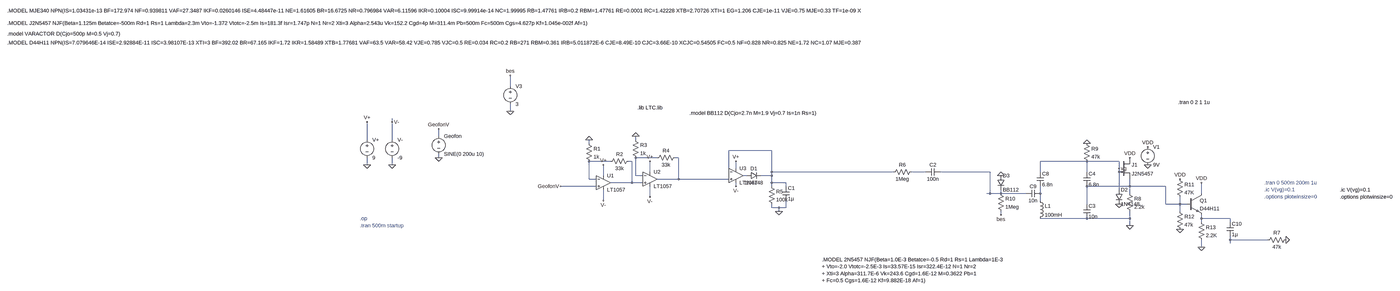
[diagram p0: schematic Automated Seismic Warning.asc, whole sheet]
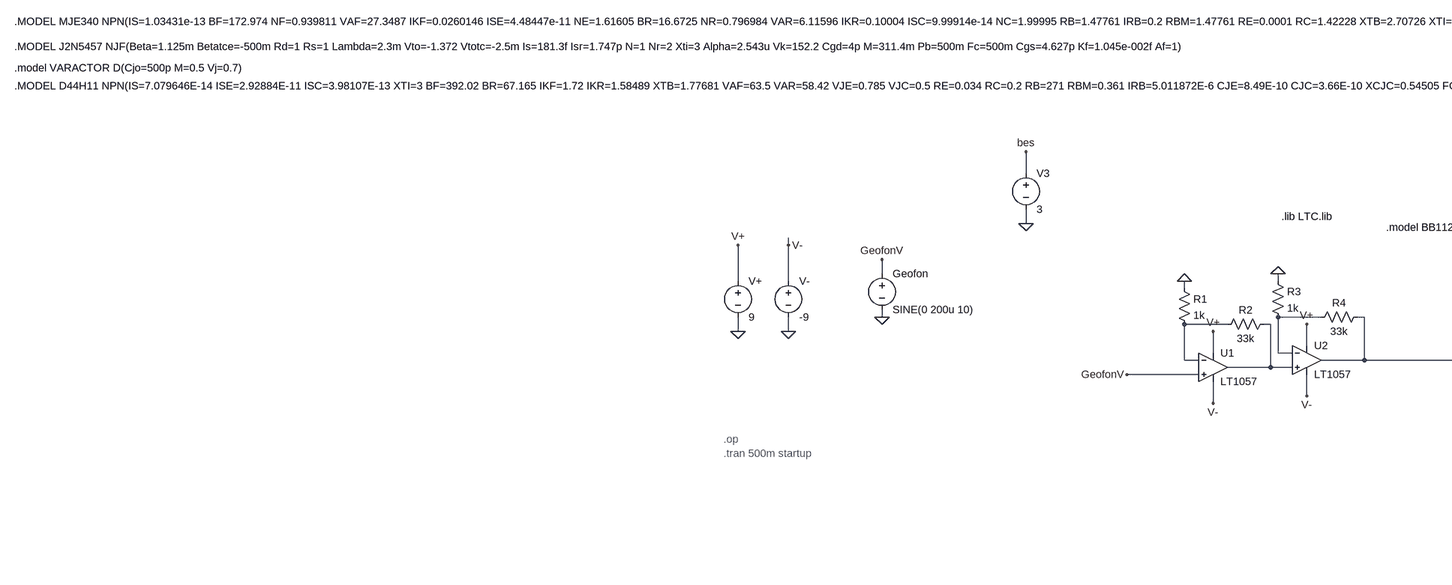
[diagram p1: schematic Automated Seismic Warning.asc, part, row 1 of 1, column 1 of 2]
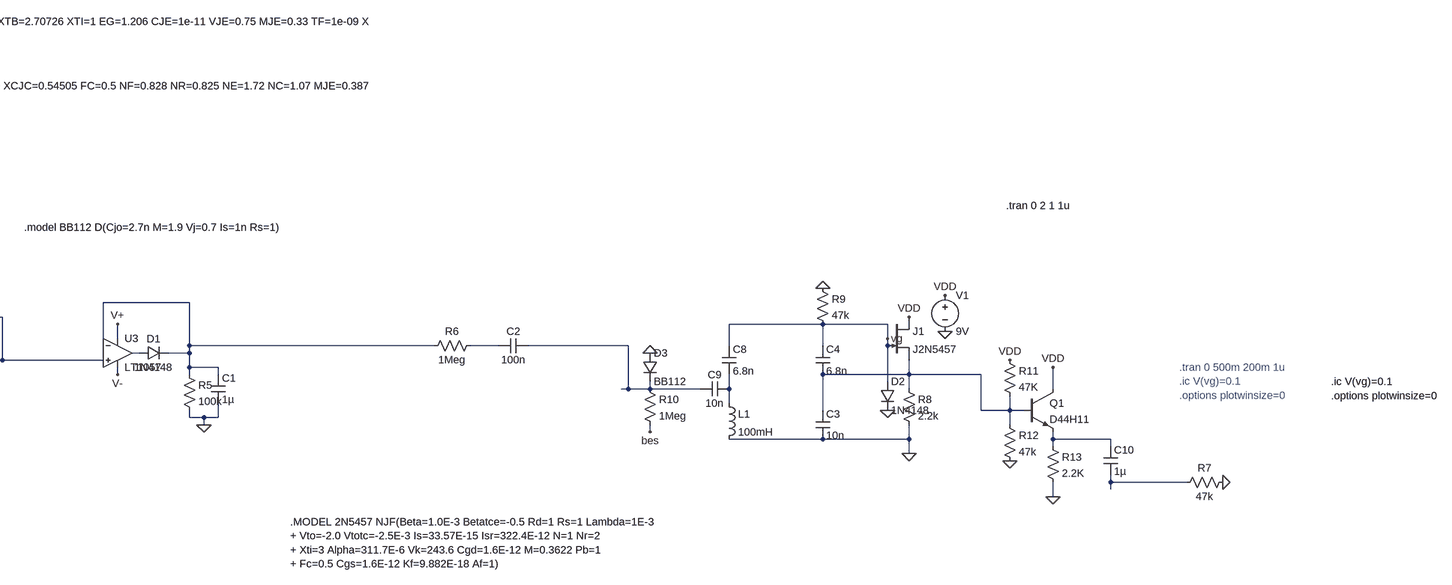
[diagram p2: schematic Automated Seismic Warning.asc, part, row 1 of 1, column 2 of 2]
Automated Seismic Warning.asc, the LTspice schematic file:
Version 4.1
SHEET 1 3796 1220
WIRE -2176 -768 -2176 -816
WIRE -2176 -656 -2176 -688
WIRE -2704 -608 -2704 -624
WIRE -2496 -544 -2496 -576
WIRE -2816 -528 -2816 -608
WIRE -2704 -528 -2704 -608
WIRE -1616 -528 -1616 -544
WIRE -1824 -512 -1824 -528
WIRE -1008 -480 -1200 -480
WIRE -2496 -448 -2496 -464
WIRE -1520 -448 -1616 -448
WIRE -1424 -448 -1440 -448
WIRE -1728 -432 -1824 -432
WIRE -1632 -432 -1648 -432
WIRE 400 -432 192 -432
WIRE 544 -432 400 -432
WIRE -2816 -416 -2816 -448
WIRE -2704 -416 -2704 -448
WIRE -1168 -400 -1168 -432
WIRE 544 -400 544 -432
WIRE -1552 -384 -1552 -432
WIRE -1200 -384 -1200 -480
WIRE -1008 -384 -1008 -480
WIRE -464 -384 -1008 -384
WIRE -320 -384 -384 -384
WIRE -32 -384 -256 -384
WIRE 192 -384 192 -432
WIRE 400 -384 400 -432
WIRE 544 -384 544 -400
WIRE -1760 -368 -1760 -416
WIRE -1616 -368 -1616 -448
WIRE -1584 -368 -1616 -368
WIRE -1120 -368 -1136 -368
WIRE -1008 -368 -1008 -384
WIRE -1008 -368 -1056 -368
WIRE -1824 -352 -1824 -432
WIRE -1792 -352 -1824 -352
WIRE -1424 -352 -1424 -448
WIRE -1424 -352 -1520 -352
WIRE -1200 -352 -1424 -352
WIRE -1632 -336 -1632 -432
WIRE -1632 -336 -1728 -336
WIRE -1584 -336 -1632 -336
WIRE -1008 -336 -1008 -368
WIRE -944 -336 -1008 -336
WIRE -1792 -320 -1952 -320
WIRE -1168 -320 -1168 -336
WIRE -1008 -320 -1008 -336
WIRE -944 -320 -944 -336
WIRE 592 -320 592 -352
WIRE 592 -320 400 -320
WIRE 752 -320 592 -320
WIRE 544 -304 544 -384
WIRE -32 -288 -32 -384
WIRE -32 -288 -48 -288
WIRE 16 -288 16 -304
WIRE 16 -288 -32 -288
WIRE 128 -288 16 -288
WIRE 192 -288 192 -320
WIRE 592 -288 592 -320
WIRE 912 -288 912 -336
WIRE -1552 -272 -1552 -320
WIRE -1760 -256 -1760 -304
WIRE 192 -256 192 -288
WIRE 400 -240 400 -320
WIRE 544 -240 544 -256
WIRE 752 -240 752 -320
WIRE 816 -240 816 -272
WIRE 816 -240 752 -240
WIRE 848 -240 816 -240
WIRE -1008 -224 -1008 -240
WIRE -976 -224 -1008 -224
WIRE -944 -224 -944 -256
WIRE -944 -224 -976 -224
WIRE -976 -208 -976 -224
WIRE 816 -208 816 -240
WIRE 16 -192 16 -208
WIRE 400 -176 192 -176
WIRE 592 -176 592 -208
WIRE 592 -176 400 -176
WIRE 912 -176 912 -192
WIRE 1040 -176 912 -176
WIRE 912 -160 912 -176
WIRE 1040 -160 1040 -176
WIRE 592 -144 592 -176
WIRE 1040 -80 1040 -96
WIRE 1264 -80 1040 -80
WIRE 1040 -64 1040 -80
WIRE 912 -48 912 -80
FLAG -2496 -576 GeofonV
FLAG -2496 -448 0
FLAG -2704 -416 0
FLAG -2816 -416 0
FLAG -2816 -608 V+
FLAG -2704 -608 V-
FLAG -1760 -256 V-
FLAG -1760 -416 V+
FLAG -1824 -528 0
FLAG -1952 -320 GeofonV
FLAG -1552 -272 V-
FLAG -1552 -432 V+
FLAG -1616 -544 0
FLAG -976 -208 0
FLAG -1168 -320 V-
FLAG -1168 -432 V+
FLAG 592 -144 0
FLAG 672 -496 VDD
FLAG 592 -448 VDD
FLAG 672 -416 0
FLAG 400 -512 0
FLAG 16 -368 0
FLAG 816 -128 0
FLAG 912 -336 VDD
FLAG 816 -352 VDD
FLAG 912 -48 0
FLAG -2176 -816 bes
FLAG -2176 -656 0
FLAG 544 -400 vg
FLAG 1344 -80 0
FLAG 544 -240 0
FLAG 16 -192 bes
DATAFLAG 1152 -80 ""
DATAFLAG 1152 -80 ""
SYMBOL voltage -2496 -560 R0
WINDOW 123 0 0 Left 0
WINDOW 39 0 0 Left 0
SYMATTR InstName Geofon
SYMATTR Value SINE(0 200u 10)
SYMBOL OpAmps\\opamp2 -1760 -400 R0
SYMATTR InstName U1
SYMATTR Value LT1057
SYMBOL voltage -2704 -544 R0
SYMATTR InstName V-
SYMATTR Value -9
SYMBOL voltage -2816 -544 R0
SYMATTR InstName V+
SYMATTR Value 9
SYMBOL res -1840 -528 R0
SYMATTR InstName R1
SYMATTR Value 1k
SYMBOL res -1632 -448 R90
WINDOW 0 0 56 VBottom 2
WINDOW 3 32 56 VTop 2
SYMATTR InstName R2
SYMATTR Value 33k
SYMBOL OpAmps\\opamp2 -1552 -416 R0
SYMATTR InstName U2
SYMATTR Value LT1057
SYMBOL res -1632 -544 R0
SYMATTR InstName R3
SYMATTR Value 1k
SYMBOL res -1424 -464 R90
WINDOW 0 0 56 VBottom 2
WINDOW 3 32 56 VTop 2
SYMATTR InstName R4
SYMATTR Value 33k
SYMBOL res -1024 -336 R0
SYMATTR InstName R5
SYMATTR Value 100k
SYMBOL cap -960 -320 R0
SYMATTR InstName C1
SYMATTR Value 1µ
SYMBOL OpAmps\\LT1057 -1168 -432 R0
SYMATTR InstName U3
SYMBOL diode -1120 -352 R270
WINDOW 0 32 32 VTop 2
WINDOW 3 0 32 VBottom 2
SYMATTR InstName D1
SYMATTR Value 1N4148
SYMBOL njf 544 -448 R0
SYMATTR InstName J1
SYMATTR Value J2N5457
SYMBOL res 576 -304 R0
SYMATTR InstName R8
SYMATTR Value 2.2k
SYMBOL cap 384 -240 R0
SYMATTR InstName C3
SYMATTR Value 10n
SYMBOL cap 384 -384 R0
SYMATTR InstName C4
SYMATTR Value 6.8n
SYMBOL cap 176 -384 R0
SYMATTR InstName C8
SYMATTR Value 6.8n
SYMBOL ind 176 -272 R0
SYMATTR InstName L1
SYMATTR Value 100mH
SYMATTR SpiceLine Rser=1m
SYMBOL voltage 672 -512 R0
WINDOW 123 0 0 Left 0
WINDOW 39 0 0 Left 0
SYMATTR InstName V1
SYMATTR Value 9V
SYMBOL res 384 -528 R0
SYMATTR InstName R9
SYMATTR Value 47k
SYMBOL diode 0 -368 R0
SYMATTR InstName D3
SYMATTR Value BB112
SYMBOL cap 192 -304 R90
WINDOW 0 0 32 VBottom 2
WINDOW 3 32 32 VTop 2
SYMATTR InstName C9
SYMATTR Value 10n
SYMBOL res 0 -304 R0
SYMATTR InstName R10
SYMATTR Value 1Meg
SYMBOL npn 848 -288 R0
SYMATTR InstName Q1
SYMATTR Value D44H11
SYMBOL res 800 -368 R0
SYMATTR InstName R11
SYMATTR Value 47K
SYMBOL res 800 -224 R0
SYMATTR InstName R12
SYMATTR Value 47k
SYMBOL res 896 -176 R0
SYMATTR InstName R13
SYMATTR Value 2.2K
SYMBOL cap 1024 -160 R0
SYMATTR InstName C10
SYMATTR Value 1µ
SYMBOL voltage -2176 -784 R0
SYMATTR InstName V3
SYMATTR Value 3
SYMBOL res -368 -400 R90
WINDOW 0 0 56 VBottom 2
WINDOW 3 32 56 VTop 2
SYMATTR InstName R6
SYMATTR Value 1Meg
SYMBOL res 1360 -96 R90
WINDOW 0 0 56 VBottom 2
WINDOW 3 32 56 VTop 2
SYMATTR InstName R7
SYMATTR Value 47k
SYMBOL diode 528 -304 R0
SYMATTR InstName D2
SYMATTR Value 1N4148
SYMBOL cap -256 -400 R90
WINDOW 0 0 32 VBottom 2
WINDOW 3 32 32 VTop 2
SYMATTR InstName C2
SYMATTR Value 100n
TEXT -2848 -176 Left 2 ;.op
TEXT -1608 -672 Left 2 !.lib LTC.lib
TEXT -2848 -144 Left 2 ;.tran 500m startup
TEXT -1376 -648 Left 2 !.model BB112 D(Cjo=2.7n M=1.9 Vj=0.7 Is=1n Rs=1)
TEXT -4424 -1232 Left 2 !.MODEL J2N5457 NJF(Beta=1.125m Betatce=-500m Rd=1 Rs=1 Lambda=2.3m Vto=-1.372 Vtotc=-2.5m Is=181.3f Isr=1.747p N=1 Nr=2 Xti=3 Alpha=2.543u Vk=152.2 Cgd=4p M=311.4m Pb=500m Fc=500m Cgs=4.627p Kf=1.045e-002f Af=1)
TEXT -4424 -1184 Left 2 !.model VARACTOR D(Cjo=500p M=0.5 Vj=0.7)
TEXT -4424 -1144 Left 2 !.MODEL D44H11 NPN(IS=7.079646E-14 ISE=2.92884E-11 ISC=3.98107E-13 XTI=3 BF=392.02 BR=67.165 IKF=1.72 IKR=1.58489 XTB=1.77681 VAF=63.5 VAR=58.42 VJE=0.785 VJC=0.5 RE=0.034 RC=0.2 RB=271 RBM=0.361 IRB=5.011872E-6 CJE=8.49E-10 CJC=3.66E-10 XCJC=0.54505 FC=0.5 NF=0.828 NR=0.825 NE=1.72 NC=1.07 MJE=0.387 MJC=0.352 EG=0.958 VCEO=80 ICRATING=10 MFG=FAIRCHILD)
TEXT -4424 -1288 Left 2 !.MODEL MJE340 NPN(IS=1.03431e-13 BF=172.974 NF=0.939811 VAF=27.3487 IKF=0.0260146 ISE=4.48447e-11 NE=1.61605 BR=16.6725 NR=0.796984 VAR=6.11596 IKR=0.10004 ISC=9.99914e-14 NC=1.99995 RB=1.47761 IRB=0.2 RBM=1.47761 RE=0.0001 RC=1.42228 XTB=2.70726 XTI=1 EG=1.206 CJE=1e-11 VJE=0.75 MJE=0.33 TF=1e-09 XTF=1 VTF=10 ITF=0.01 CJC=1e-11 VJC=0.75 MJC=0.33 XCJC=0.9 FC=0.5 CJS=0 VJS=0.75 MJS=0.5 TR=1e-07 PTF=0 Vceo=300 Icrating=0.5A mfg=OnSemi)
TEXT -784 8 Left 2 !.MODEL 2N5457 NJF(Beta=1.0E-3 Betatce=-0.5 Rd=1 Rs=1 Lambda=1E-3\n+ Vto=-2.0 Vtotc=-2.5E-3 Is=33.57E-15 Isr=322.4E-12 N=1 Nr=2\n+ Xti=3 Alpha=311.7E-6 Vk=243.6 Cgd=1.6E-12 M=0.3622 Pb=1\n+ Fc=0.5 Cgs=1.6E-12 Kf=9.882E-18 Af=1)
TEXT 1248 -336 Left 2 ;.tran 0 500m 200m 1u\n.ic V(vg)=0.1\n.options plotwinsize=0
TEXT 808 -696 Left 2 !.tran 0 2 1 1u
TEXT 1752 -304 Left 2 !.ic V(vg)=0.1\n.options plotwinsize=0

The netlist it stands for:
* Automated Seismic Warning.asc
V§Geofon GeofonV 0 SINE(0 200u 10)
X§U1 GeofonV N004 V+ V- N005 LT1057  ; pins In+ In- V+ V- OUT
V- V- 0 -9
V+ V+ 0 9
R1 0 N004 1k
R2 N005 N004 33k
X§U2 N005 N002 V+ V- N003 LT1057  ; pins In+ In- V+ V- OUT
R3 0 N002 1k
R4 N003 N002 33k
R5 N001 0 100k
C1 N001 0 1µ
X§U3 N003 N001 V+ V- N008 LT1057  ; pins In+ In- V+ V- OUT
D1 N008 N001 1N4148
J1 VDD vg N009 J2N5457
R8 N009 0 2.2k
C3 N009 0 10n
C4 vg N009 6.8n
C8 vg N010 6.8n
L1 N010 0 100mH Rser=1m
V1 VDD 0 9V
R9 0 vg 47k
D3 0 N007 BB112
C9 N010 N007 10n
R10 N007 bes 1Meg
Q1 VDD N009 N011 0 D44H11
R11 VDD N009 47K
R12 N009 0 47k
R13 N011 0 2.2K
C10 N011 N012 1µ
V3 bes 0 3
R6 N006 N001 1Meg
R7 0 N012 47k
D2 vg 0 1N4148
C2 N007 N006 100n
.model D D
.lib standard.dio
.model NPN NPN
.model PNP PNP
.lib standard.bjt
.model NJF NJF
.model PJF PJF
.lib standard.jft
* .op
.lib LTC.lib
* .tran 500m startup
.model BB112 D(Cjo=2.7n M=1.9 Vj=0.7 Is=1n Rs=1)
.MODEL J2N5457 NJF(Beta=1.125m Betatce=-500m Rd=1 Rs=1 Lambda=2.3m Vto=-1.372 Vtotc=-2.5m Is=181.3f Isr=1.747p N=1 Nr=2 Xti=3 Alpha=2.543u Vk=152.2 Cgd=4p M=311.4m Pb=500m Fc=500m Cgs=4.627p Kf=1.045e-002f Af=1)
.model VARACTOR D(Cjo=500p M=0.5 Vj=0.7)
.MODEL D44H11 NPN(IS=7.079646E-14 ISE=2.92884E-11 ISC=3.98107E-13 XTI=3 BF=392.02 BR=67.165 IKF=1.72 IKR=1.58489 XTB=1.77681 VAF=63.5 VAR=58.42 VJE=0.785 VJC=0.5 RE=0.034 RC=0.2 RB=271 RBM=0.361 IRB=5.011872E-6 CJE=8.49E-10 CJC=3.66E-10 XCJC=0.54505 FC=0.5 NF=0.828 NR=0.825 NE=1.72 NC=1.07 MJE=0.387 MJC=0.352 EG=0.958 VCEO=80 ICRATING=10 MFG=FAIRCHILD)
.MODEL MJE340 NPN(IS=1.03431e-13 BF=172.974 NF=0.939811 VAF=27.3487 IKF=0.0260146 ISE=4.48447e-11 NE=1.61605 BR=16.6725 NR=0.796984 VAR=6.11596 IKR=0.10004 ISC=9.99914e-14 NC=1.99995 RB=1.47761 IRB=0.2 RBM=1.47761 RE=0.0001 RC=1.42228 XTB=2.70726 XTI=1 EG=1.206 CJE=1e-11 VJE=0.75 MJE=0.33 TF=1e-09 XTF=1 VTF=10 ITF=0.01 CJC=1e-11 VJC=0.75 MJC=0.33 XCJC=0.9 FC=0.5 CJS=0 VJS=0.75 MJS=0.5 TR=1e-07 PTF=0 Vceo=300 Icrating=0.5A mfg=OnSemi)
.MODEL 2N5457 NJF(Beta=1.0E-3 Betatce=-0.5 Rd=1 Rs=1 Lambda=1E-3
+ Vto=-2.0 Vtotc=-2.5E-3 Is=33.57E-15 Isr=322.4E-12 N=1 Nr=2
+ Xti=3 Alpha=311.7E-6 Vk=243.6 Cgd=1.6E-12 M=0.3622 Pb=1
+ Fc=0.5 Cgs=1.6E-12 Kf=9.882E-18 Af=1)
* .tran 0 500m 200m 1u
* .ic V(vg)=0.1
* .options plotwinsize=0
.tran 0 2 1 1u
.ic V(vg)=0.1
.options plotwinsize=0
.lib LTC.lib
.backanno
.end